# Altium schematic sheet ShoulderDriverChannel.SchDoc: KV10 BLDC Control
size Letter; Revision: B1; SheetNumber: 1; SheetTotal: 1
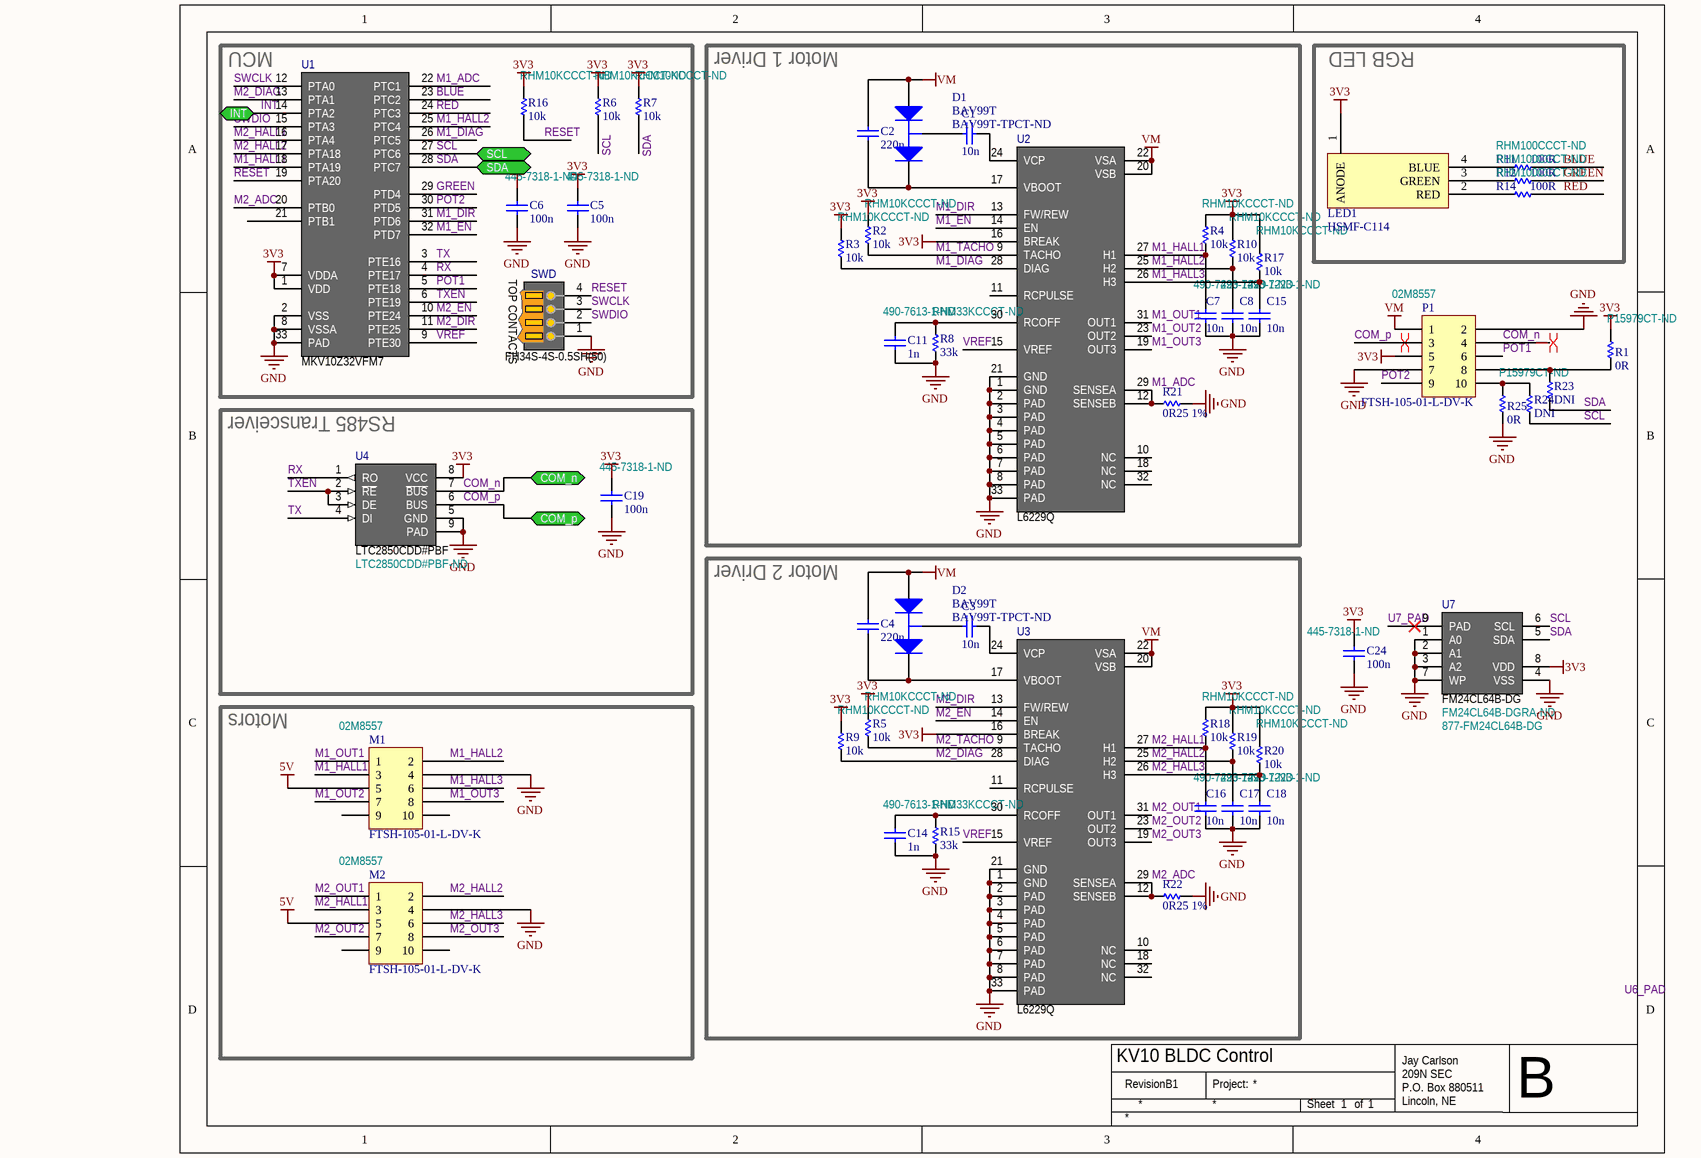
[diagram p0: ShoulderDriverChannel.SchDoc]

## Parts
C1  10n  [CAPC1005N]
C2  220n  [CAPC1005N]
C3  10n  [CAPC1005N]
C4  220n  [CAPC1005N]
C5  100n  Supplier Part Number 1: 445-7318-1-ND  [CAPC0603N]
C6  100n  Supplier Part Number 1: 445-7318-1-ND  [CAPC0603N]
C7  10n  Supplier Part Number 1: 490-7223-1-ND  [CAPC0603N]
C8  10n  Supplier Part Number 1: 490-7223-1-ND  [CAPC0603N]
C11  1n  Supplier Part Number 1: 490-7613-1-ND  [CAPC0603N]
C14  1n  Supplier Part Number 1: 490-7613-1-ND  [CAPC0603N]
C15  10n  Supplier Part Number 1: 490-7223-1-ND  [CAPC0603N]
C16  10n  Supplier Part Number 1: 490-7223-1-ND  [CAPC0603N]
C17  10n  Supplier Part Number 1: 490-7223-1-ND  [CAPC0603N]
C18  10n  Supplier Part Number 1: 490-7223-1-ND  [CAPC0603N]
C19  100n  Supplier Part Number 1: 445-7318-1-ND  [CAPC0603N]
C24  100n  Supplier Part Number 1: 445-7318-1-ND  [CAPC0603N]
D1  BAV99T  Supplier Part Number 1: BAV99T-TPCT-ND  [SOT-523 (SC-75)]
D2  BAV99T  Supplier Part Number 1: BAV99T-TPCT-ND  [SOT-523 (SC-75)]
LED1  HSMF-C114  [HSMF-C114]
M1  FTSH-105-01-L-DV-K  Supplier Part Number 1: 02M8557  [FTSH-105-01-L-DV-K]
M2  FTSH-105-01-L-DV-K  Supplier Part Number 1: 02M8557  [FTSH-105-01-L-DV-K]
P1  FTSH-105-01-L-DV-K  Supplier Part Number 1: 02M8557  [FTSH-105-01-L-DV-K]
R1  0R  Supplier Part Number 1: P15979CT-ND  [RESC0603N]
R2  10k  Supplier Part Number 1: RHM10KCCCT-ND  [RESC0603N]
R3  10k  Supplier Part Number 1: RHM10KCCCT-ND  [RESC0603N]
R4  10k  Supplier Part Number 1: RHM10KCCCT-ND  [RESC0603N]
R5  10k  Supplier Part Number 1: RHM10KCCCT-ND  [RESC0603N]
R6  10k  Supplier Part Number 1: RHM10KCCCT-ND  [RESC0603N]
R7  10k  Supplier Part Number 1: RHM10KCCCT-ND  [RESC0603N]
R8  33k  Supplier Part Number 1: RHM33KCCCT-ND  [RESC0603N]
R9  10k  Supplier Part Number 1: RHM10KCCCT-ND  [RESC0603N]
R10  10k  Supplier Part Number 1: RHM10KCCCT-ND  [RESC0603N]
R11  100R  Supplier Part Number 1: RHM100CCCT-ND  [RESC0603N]
R12  100R  Supplier Part Number 1: RHM100CCCT-ND  [RESC0603N]
R14  100R  Supplier Part Number 1: RHM100CCCT-ND  [RESC0603N]
R15  33k  Supplier Part Number 1: RHM33KCCCT-ND  [RESC0603N]
R16  10k  Supplier Part Number 1: RHM10KCCCT-ND  [RESC0603N]
R17  10k  Supplier Part Number 1: RHM10KCCCT-ND  [RESC0603N]
R18  10k  Supplier Part Number 1: RHM10KCCCT-ND  [RESC0603N]
R19  10k  Supplier Part Number 1: RHM10KCCCT-ND  [RESC0603N]
R20  10k  Supplier Part Number 1: RHM10KCCCT-ND  [RESC0603N]
R21  0R25 1%  [RESC1608N]
R22  0R25 1%  [RESC1608N]
R23  DNI  [RESC0603N]
R24  DNI  [RESC0603N]
R25  0R  Supplier Part Number 1: P15979CT-ND  [RESC0603N]
SWD  FH34S-4S-0.5SH(50)  [FH34S-4S-0.5SH(50)]
U1  MKV10Z32VFM7  [QFN50P500X500-32V2N]
U2  L6229Q  [L6229Q]
U3  L6229Q  [L6229Q]
U4  LTC2850CDD#PBF  Supplier Part Number 1: LTC2850CDD#PBF-ND  [DFN50P300X300X75-8N]
U7  FM24CL64B-DG  Supplier Part Number 1: FM24CL64B-DGRA-ND  Supplier Part Number 2: 877-FM24CL64B-DG  [DFN95P400X445X80_HS-9N]

## Blocks framed on the sheet
MCU: C5 C6 R6 R7 R16 SWD U1
Motor 1 Driver: C1 C2 C7 C8 C11 C15 D1 R2-R4 R8 R10 R17 R21 U2
RGB LED: LED1 R11 R12 R14
RS485 Transceiver: C19 U4
Motor 2 Driver: C3 C4 C14 C16-C18 D2 R5 R9 R15 R18-R20 R22 U3
Motors: M1 M2

## Ports
COM_n (bidir), COM_p (bidir), INT (bidir), SCL (bidir), SDA (bidir)

## Nets
3V3: C5.2 C6.2 C19.2 C24.2 LED1.1(ANODE) P1.5 R1.2 R2.1 R3.1 R4.2 R5.1 R6.2 R7.2 R9.1 R10.2 R16.2 R17.2 R18.2 R19.2 R20.2 U1.1(VDD) U1.7(VDDA) U2.16(BREAK) U3.16(BREAK) U4.8(VCC) U7.8(VDD)
5V: M1.5 M2.5
GND: C5.1 C6.1 C7.1 C8.1 C11.1 C14.1 C15.1 C16.1 C17.1 C18.1 C19.1 C24.1 M1.4 M2.4 P1.2 P1.7 R8.1 R15.1 R21.1 R22.1 R25.1 SWD.1 U1.2(VSS) U1.8(VSSA) U1.33(PAD) U2.1(GND) U2.2(PAD) U2.3(PAD) U2.4(PAD) U2.5(PAD) U2.6(PAD) U2.7(PAD) U2.8(PAD) U2.21(GND) U2.33(PAD) U3.1(GND) U3.2(PAD) U3.3(PAD) U3.4(PAD) U3.5(PAD) U3.6(PAD) U3.7(PAD) U3.8(PAD) U3.21(GND) U3.33(PAD) U4.5(GND) U4.9(PAD) U7.1(A0) U7.2(A1) U7.3(A2) U7.4(VSS) U7.7(WP)
VM: C2.2 C4.2 D1.1(A) D2.1(A) P1.1 U2.20(VSB) U2.22(VSA) U3.20(VSB) U3.22(VSA)
BLUE: R11.1 U1.23(PTC2)
COM_n: P1.4 U4.7(~{BUS}) ; port COM_n
COM_p: P1.3 U4.6(BUS) ; port COM_p
GREEN: R12.1 U1.29(PTD4)
INT: U1.14(PTA2) ; port INT
M1_ADC: R21.2 U1.22(PTC1) U2.12(SENSEB) U2.29(SENSEA)
M1_DIAG: R3.2 U1.26(PTC5) U2.28(DIAG)
M1_DIR: U1.31(PTD6) U2.13(FW/REW)
M1_EN: U1.32(PTD7) U2.14(EN)
M1_HALL1: C7.2 M1.3 R4.1 U1.18(PTA19) U2.27(H1)
M1_HALL2: C8.2 M1.2 R10.1 U1.25(PTC4) U2.25(H2)
M1_HALL3: C15.2 M1.6 R17.1 U2.26(H3)
M1_OUT1: M1.1 U2.31(OUT1)
M1_OUT2: M1.7 U2.23(OUT2)
M1_OUT3: M1.8 U2.19(OUT3)
M1_TACHO: R2.2 U2.9(TACHO)
M2_ADC: R22.2 U1.20(PTB0) U3.12(SENSEB) U3.29(SENSEA)
M2_DIAG: R9.2 U1.13(PTA1) U3.28(DIAG)
M2_DIR: U1.11(PTE25) U3.13(FW/REW)
M2_EN: U1.10(PTE24) U3.14(EN)
M2_HALL1: C16.2 M2.3 R18.1 U1.16(PTA4) U3.27(H1)
M2_HALL2: C17.2 M2.2 R19.1 U1.17(PTA18) U3.25(H2)
M2_HALL3: C18.2 M2.6 R20.1 U3.26(H3)
M2_OUT1: M2.1 U3.31(OUT1)
M2_OUT2: M2.7 U3.23(OUT2)
M2_OUT3: M2.8 U3.19(OUT3)
M2_TACHO: R5.2 U3.9(TACHO)
POT1: P1.6 U1.5(PTE18)
POT2: P1.9 U1.30(PTD5)
RED: R14.1 U1.24(PTC3)
RESET: R16.1 SWD.4 U1.19(PTA20)
RX: U1.4(PTE17) U4.1(RO)
SCL: R6.1 R24.2 U1.27(PTC6) U7.6(SCL) ; port SCL
SDA: R7.1 R23.2 U1.28(PTC7) U7.5(SDA) ; port SDA
SWCLK: SWD.3 U1.12(PTA0)
SWDIO: SWD.2 U1.15(PTA3)
TX: U1.3(PTE16) U4.4(DI)
TXEN: U1.6(PTE19) U4.2(~{RE}) U4.3(DE)
U7_PAD: U7.9(PAD)
VREF: U1.9(PTE30) U2.15(VREF) U3.15(VREF)
NetC1_1: C1.1 D1.3(C)
NetC1_2: C1.2 U2.24(VCP)
NetC2_1: C2.1 D1.2(K) U2.17(VBOOT)
NetC3_1: C3.1 D2.3(C)
NetC3_2: C3.2 U3.24(VCP)
NetC4_1: C4.1 D2.2(K) U3.17(VBOOT)
NetC11_2: C11.2 R8.2 U2.30(RCOFF)
NetC14_2: C14.2 R15.2 U3.30(RCOFF)
NetLED1_2: LED1.2(RED) R14.2
NetLED1_3: LED1.3(GREEN) R12.2
NetLED1_4: LED1.4(BLUE) R11.2
NetP1_8: P1.8 R1.1 R23.1
NetP1_10: P1.10 R24.1 R25.2

Not connected (* = marked no-connect by the designer): M1 9 10; M2 9 10; U1 21(PTB1); U2 10(NC) 11(RCPULSE) 18(NC) 32(NC); U3 10(NC) 11(RCPULSE) 18(NC) 32(NC)

## Layout directives
differential pair: COM_n, COM_p

## Notes on the sheet
- Labels drawn without touching a wire or pin: U6_PAD
- Revision
- Project:
- Sheet
- of
- Jay Carlson
  209N SEC
  P.O. Box 880511
  Lincoln, NE 68588-0511
- B
- (in symbol FH34S-4S-0.5SH(50)) TOP CONTACTS

## Library data of the parts
C1-C8 C11 C14-C19 C24 = Cap Semi: Capacitor (Semiconductor SIM Model); Published: 8-Jun-2000; LatestRevisionDate: 29-May-2009; LatestRevisionNote: IPC-7351 Footprint Added.; PackageReference: C1206; Publisher: Altium Limited; PackageDescription: Chip Capacitor; Supplier 1: Digi-Key
  C1 C3: Supplier Part Number 1: 1276-1500-1-ND
  C2 C4: Supplier Part Number 1: 1276-1746-1-ND
D1 D2 = BAV99T: Silicon Switching Diode for High-Speed Switching; Published: 21-Mar-2003; DatasheetDocument: Oct-1999; PackageDocument: Sep-2001; PackageReference: SC-75; Publisher: Altium Limited; ComponentLink1Description: Manufacturer Link; ComponentLink1URL: http://www.infineon.com/; ComponentLink2Description: Datasheet; ComponentLink2URL: http://www.infineon.com/upload/Document/cmc_upload/documents/080/799/bav99series_1.pdf; Supplier 1: Digi-Key
LED1 = HSMF-C114: LED CHIP RGB 1.6X1.5X0.35MM SMD; Manufacturer: Avago Technologies US Inc.; Color: Red, Green, Blue (RGB); Millicandela Rating: 85mcd Red, 180mcd Green, 70mcd Blue; Voltage - Forward (Vf) Typ: 1.9V Red, 3.4V Green, 3.4V Blue; Current - Test: 20mA; Wavelength - Dominant: 626nm, 525nm, 470nm; Wavelength - Peak: 637nm, 523nm, 468nm; Viewing Angle: 140°, 145°, 145°; Lens Type: Diffused; Lens Style/Size: Rectangle with Flat Top, 1.5mm x 1.1mm; Supplier 1: Digi-Key; Supplier Part Number 1: 516-1795-1-ND; Manufacturer Part Number: HSMF-C114; RoHS: RoHS Compliant; Category: Optoelectronics; Stock 1: 12490; Pricing 1: 1=2.03, 10=1.62, 100=1.125, 250=0.99, 500=0.8325, 1000=0.675 (USD); Package / Case: 0606 (1616 Metric); Size / Dimension: 1.60mm L x 1.50mm W; Height: 0.35mm; Mounting Type: Surface Mount; Packaging: Cut Tape (CT); Luminous Flux @ Current - Test: -; ComponentLink1URL: http://www.avagotech.com/docs/AV02-2451EN; ComponentLink1Description: http://www.avagotech.com/docs/AV02-2451EN
M1 M2 P1 = MHDR2X5: Header, 5-Pin, Dual row; LatestRevisionDate: 17-Jul-2002; LatestRevisionNote: Re-released for DXP Platform.; Publisher: Altium Limited; Supplier 1: Newark
R1-R12 R14-R25 = Res Semi: Semiconductor Resistor; Published: 8-Jun-2000; LatestRevisionDate: 17-Jul-2002; LatestRevisionNote: Re-released for DXP Platform.; PackageReference: AXIAL-0.5; Publisher: Altium Limited; PackageDescription: Axial Device, Thru-Hole; 2 Leads; 0.5 in Pin Spacing
  R1-R12 R14-R20 R25: Supplier 1: Digi-Key
  R21 R22: Supplier 1: Digi-Key; Supplier Part Number 1: CSR0603FKR250CT-ND
SWD = FH34S-4S-0.5SH(50): CONN FPC/FFC 4POS .5MM SMD GOLD; Manufacturer: Hirose Electric Co Ltd; Flat Flex Type: FFC, FPC; Connector/Contact Type: Contacts, Top; Number of Positions: 4; Pitch: 0.020" (0.50mm); FFC, FCB Thickness: 0.30mm; Locking Feature: Rotary Lock, Backlock; Cable End Type: Tapered; Actuator Material: Polyamide (PA), Nylon; Voltage Rating: 50V; Material Flammability Rating: UL94 V-0; Current Rating: 0.5A; Supplier 1: Digi-Key; Manufacturer Part Number: FH34S-4S-0.5SH(50); RoHS: RoHS Compliant; Category: Connectors, Interconnects; Stock 1: 12507; Pricing 1: 1=1.51, 10=1.374, 25=1.2904, 50=1.2342, 100=1.1781, 250=1.06592, 500=0.98176, 1000=0.825, 2500=0.77 (USD); Packaging: Cut Tape (CT); Mounting Type: Surface Mount, Right Angle; Termination: Solder; Height Above Board: 0.039" (1.00mm); Contact Material: Phosphor Bronze; Contact Finish: Gold; Housing Material: Liquid Crystal Polymer (LCP); Features: Zero Insertion Force (ZIF); Operating Temperature: -55°C ~ 85°C; ComponentLink1URL: http://www.hirose.co.jp/cataloge_hp/ed_FH34S_20140305.pdf; ComponentLink1Description: http://www.hirose.co.jp/cataloge_hp/ed_FH34S_20140305.pdf; Supplier Part Number 1: HFT104CT-ND
U1 = MKV10Z32VFM7: Kinetis Cortex-M0+75 MHz Motor Control 32QFN; Manufacturer: Freescale Semiconductor; Core Processor: ARM® Cortex™-M0+; Core Size: 32-Bit; Speed: 75MHz; Connectivity: I²C, SPI, UART/USART; Peripherals: DMA, WDT; Number of I/O: 28; Program Memory Size: 32KB (32K x 8); Program Memory Type: FLASH; RAM Size: 8K x 8; Voltage - Supply (Vcc/Vdd): 1.71 V ~ 3.6 V; Data Converters: A/D 16x12b, D/A 1x12b; Oscillator Type: Internal; Supplier 1: Digi-Key; Manufacturer Part Number: MKV10Z32VFM7; RoHS: RoHS Compliant; Category: Integrated Circuits (ICs); Stock 1: 490; Pricing 1: 1=2.7, 10=2.55, 25=2.4, 100=1.95 (USD); Packaging: Tray; EEPROM Size: -; Operating Temperature: -40°C ~ 105°C; Package / Case: 32-VFQFN Exposed Pad; Supplier Device Package: 32-QFN; ComponentLink1URL: http://cache.freescale.com/files/microcontrollers/doc/data_sheet/KV10P48M75.pdf; ComponentLink1Description: http://cache.freescale.com/files/microcontrollers/doc/data_sheet/KV10P48M75.pdf; Supplier Part Number 1: MKV10Z32VFM7-ND
U2 U3 = L6229Q: IC MOTOR DRIVER PAR 32VFQFPN; Manufacturer: STMicroelectronics; Manufacturer Part Number: L6229QTR; Motor Type - Stepper: Multiphase; Motor Type - AC, DC: Brushless DC (BLDC); Function: Driver - Fully Integrated, Control and Power Stage; Output Configuration: 3-Phase Bridge, (1) Single; Interface: Parallel; Current - Output: 1.4A; Voltage - Supply: 8 V ~ 52 V; Supplier 1: Digi-Key; RoHS: RoHS Compliant; Category: Integrated Circuits (ICs); Stock 1: 3274; Pricing 1: 1=6.75, 10=6.048, 25=5.438, 100=4.9458, 250=4.47704, 500=4.00824, 1000=3.37536 (USD); Packaging: Cut Tape (CT); Applications: General Purpose; Voltage - Load: 8 V ~ 52 V; Operating Temperature: -40°C ~ 150°C; Mounting Type: Surface Mount; Package / Case: 32-VFQFN Exposed Pad; Supplier Device Package: 32-VFQFPN Exposed Pad (5x5); ComponentLink1URL: http://www.st.com/web/en/resource/technical/document/datasheet/CD00218185.pdf; ComponentLink1Description: http://www.st.com/web/en/resource/technical/document/datasheet/CD00218185.pdf; Supplier 2: Newark; Supplier Part Number 1: 497-8495-1-ND; Supplier Part Number 2: 69W9785
U4 = LTC2850CDD#PBF: IC TXRX RS485 20MBPS 8-DFN; Manufacturer: Linear Technology; Manufacturer Part Number: LTC2850CMS8#PBF; Protocol: RS422, RS485; Number of Drivers/Receivers: 1/1; Duplex: Half; Receiver Hysteresis: 25mV; Voltage - Supply: 3 V ~ 3.6 V; Supplier 1: Digi-Key; RoHS: RoHS Compliant; Category: Integrated Circuits (ICs); Stock 1: 2103; Pricing 1: 1=2.91, 25=2.07, 100=1.71 (USD); Packaging: Tube; Type: Transceiver; Data Rate: 20Mbps; Operating Temperature: 0°C ~ 70°C; Mounting Type: Surface Mount; Package / Case: 8-TSSOP, 8-MSOP (0.118", 3.00mm Width); Supplier Device Package: 8-MSOP; ComponentLink1URL: http://www.linear.com/docs/19198; ComponentLink1Description: http://www.linear.com/docs/19198
U7 = FM24CL64B-DG: IC FRAM 64KBIT 1MHZ 8TDFN; Manufacturer: Cypress Semiconductor Corp; Format - Memory: RAM; Memory Type: FRAM (Ferroelectric RAM); Memory Size: 64K (8K x 8); Interface: I²C, 2-Wire Serial; Voltage - Supply: 2.7 V ~ 3.6 V; Supplier 1: Digi-Key; Manufacturer Part Number: FM24CL64B-DG; RoHS: RoHS Compliant; Category: Integrated Circuits (ICs); Stock 1: 94; Pricing 1: 1=3.63, 25=3.1352, 100=2.97, 250=2.475, 500=2.3925, 750=2.31, 1000=2.2275, 2500=2.145 (USD); Packaging: Tube; Speed: 1MHz; Operating Temperature: -40°C ~ 85°C; Package / Case: 8-WDFN Exposed Pad; Supplier Device Package: 8-TDFN (4x4.5); ComponentLink1URL: http://www.cypress.com/?docID=48378; ComponentLink1Description: http://www.cypress.com/?docID=48378; Supplier 2: Mouser